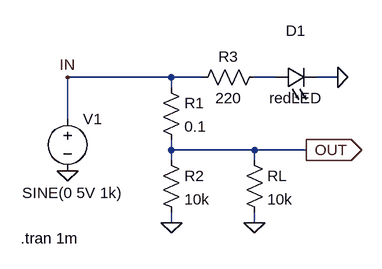
[diagram p0: schematic Attn+LED.asc]
Attn+LED.asc, the LTspice schematic file:
Version 4
SHEET 1 880 680
WIRE 288 48 128 48
WIRE 336 48 288 48
WIRE 448 48 416 48
WIRE 544 48 512 48
WIRE 288 64 288 48
WIRE 128 112 128 48
WIRE 288 160 288 144
WIRE 416 160 288 160
WIRE 496 160 416 160
WIRE 288 176 288 160
WIRE 416 176 416 160
WIRE 288 272 288 256
WIRE 416 272 416 256
FLAG 128 192 0
FLAG 288 272 0
FLAG 496 160 OUT
IOPIN 496 160 Out
FLAG 544 48 0
FLAG 128 48 IN
FLAG 416 272 0
SYMBOL voltage 128 96 R0
WINDOW 3 -70 130 Left 2
WINDOW 123 0 0 Left 2
WINDOW 39 0 0 Left 2
SYMATTR InstName V1
SYMATTR Value SINE(0 5V 1k)
SYMBOL res 272 48 R0
SYMATTR InstName R1
SYMATTR Value 0.1
SYMBOL res 272 160 R0
SYMATTR InstName R2
SYMATTR Value 10k
SYMBOL res 432 32 R90
WINDOW 0 0 56 VBottom 2
WINDOW 3 32 56 VTop 2
SYMATTR InstName R3
SYMATTR Value 220
SYMBOL LED 448 64 R270
WINDOW 0 72 32 VTop 2
WINDOW 3 0 32 VBottom 2
SYMATTR InstName D1
SYMATTR Value redLED
SYMBOL res 400 160 R0
SYMATTR InstName RL
SYMATTR Value 10k
TEXT 56 296 Left 2 !.tran 1m

The netlist it stands for:
* Attn+LED.asc
V1 IN 0 SINE(0 5V 1k)
R1 IN OUT 0.1
R2 OUT 0 10k
R3 N001 IN 220
D1 N001 0 redLED
RL OUT 0 10k
.model D D
.lib standard.dio
.tran 1m
.backanno
.end